# Altium project waffling60-SI.PrjPcb
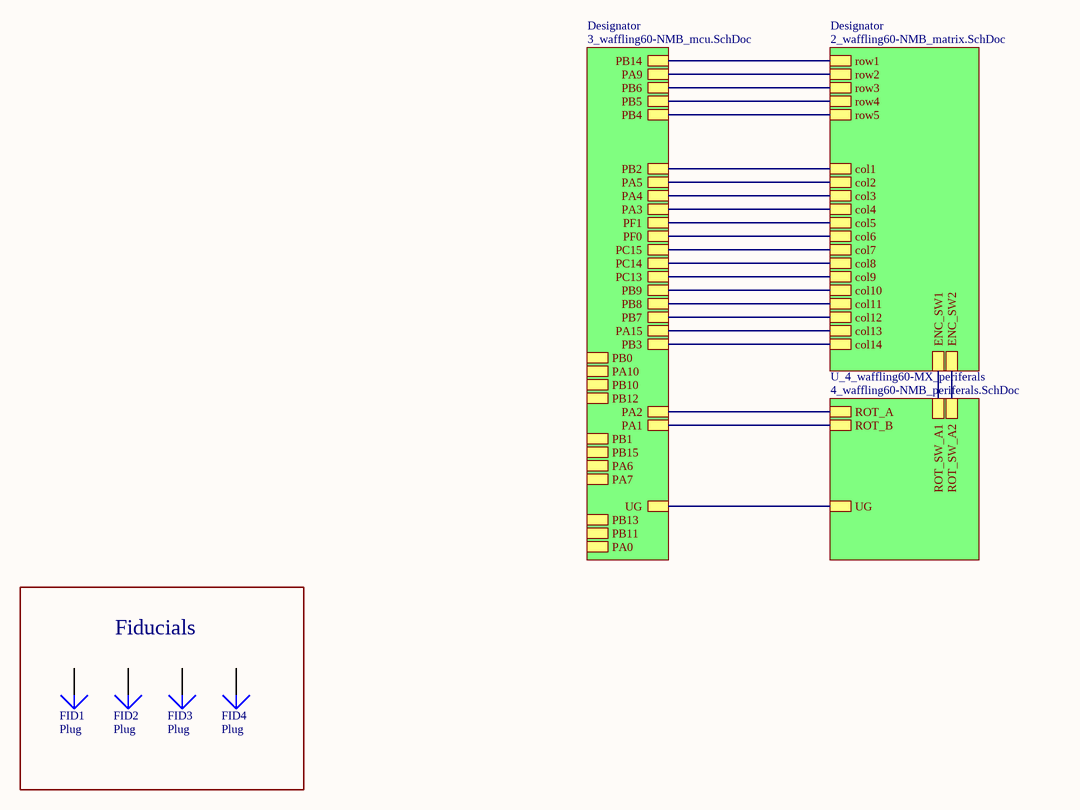
[diagram p0: 1_waffling60-NMB_top.SchDoc]
ProjectTitle: Waffling60 - MX Solder; Revision: D1
3 sheets, 191 parts. Net scope: hierarchical (ports join the sheet entries above them; power ports are global).
Board file: Waffling60-NMB.PcbDoc
Sheets:
  1_waffling60-NMB_top.SchDoc
    Designator = 3_waffling60-NMB_mcu.SchDoc
    Designator = 2_waffling60-NMB_matrix.SchDoc

## Sheet 1_waffling60-NMB_top.SchDoc: =ProjectTitle
size A4; Engineer: 4pplet; Address1: github.com/4pplet/waffling60; Address2: Licence: CERN-OHL-S; Revision: D1; SheetNumber: 1; SheetTotal: 3; ProjectName: waffling60

### Parts
FID1  Plug  [Fiducial_Nordic]  (no BOM)
FID2  Plug  [Fiducial_Nordic]  (no BOM)
FID3  Plug  [Fiducial_Nordic]  (no BOM)
FID4  Plug  [Fiducial_Nordic]  (no BOM)

### Blocks framed on the sheet
Fiducials: FID1-FID4

### Sub-sheets
Designator = 3_waffling60-NMB_mcu.SchDoc: PB8, PA3, PA4, PB11, PB12, PB15, PB13, PB3, PB0, PA9, PA5, PA2, PB7, PB9, PB10, PC14, PA0, PB6, PB2, PB1, PB4, PC15, PA10, PC13, PB14, PA7, PA1, PA6, PA15, PB5, PF1, PF0, UG
Designator = 2_waffling60-NMB_matrix.SchDoc: col6, col8, col5, col7, col3, col2, col1, col4, col9, row3, row1, row4, row2, row5, col11, col10, col14, col13, col12, ENC_SW1, ENC_SW2
U_4_waffling60-MX_periferals = 4_waffling60-NMB_periferals.SchDoc (file not in this document): ROT_A, ROT_B, ROT_SW_A1, ROT_SW_A2, UG

### Nets
col1: sheet Designator/PB2, sheet Designator/col1
col2: sheet Designator/PA5, sheet Designator/col2
col3: sheet Designator/PA4, sheet Designator/col3
col4: sheet Designator/PA3, sheet Designator/col4
col5: sheet Designator/PF1, sheet Designator/col5
col6: sheet Designator/PF0, sheet Designator/col6
col7: sheet Designator/PC15, sheet Designator/col7
col8: sheet Designator/PC14, sheet Designator/col8
col9: sheet Designator/PC13, sheet Designator/col9
col10: sheet Designator/PB9, sheet Designator/col10
col11: sheet Designator/PB8, sheet Designator/col11
col12: sheet Designator/PB7, sheet Designator/col12
col13: sheet Designator/PA15, sheet Designator/col13
col14: sheet Designator/PB3, sheet Designator/col14
PA1: sheet Designator/PA1, sheet U_4_waffling60-MX_periferals/ROT_B
PA2: sheet Designator/PA2, sheet U_4_waffling60-MX_periferals/ROT_A
PA9: sheet Designator/PA9, sheet Designator/row2
PB4: sheet Designator/PB4, sheet Designator/row5
PB5: sheet Designator/PB5, sheet Designator/row4
PB6: sheet Designator/PB6, sheet Designator/row3
PB14: sheet Designator/PB14, sheet Designator/row1
(unnamed): sheet Designator/UG, sheet U_4_waffling60-MX_periferals/UG
(unnamed): sheet Designator/ENC_SW1, sheet U_4_waffling60-MX_periferals/ROT_SW_A1
(unnamed): sheet Designator/ENC_SW2, sheet U_4_waffling60-MX_periferals/ROT_SW_A2

Not connected (* = marked no-connect by the designer): FID1 1; FID2 1; FID3 1; FID4 1

### Notes on the sheet
- Title
- Size:
- Date:
- A4
- Number:
- Time:
- Revision:
- Sheet
- of
- File:

## Sheet 3_waffling60-NMB_mcu.SchDoc: =ProjectTitle
size A4; Address1: github.com/4pplet/waffling60; Address2: Licence: CERN-OHL-S; Revision: D1; SheetNumber: 3; SheetTotal: 3
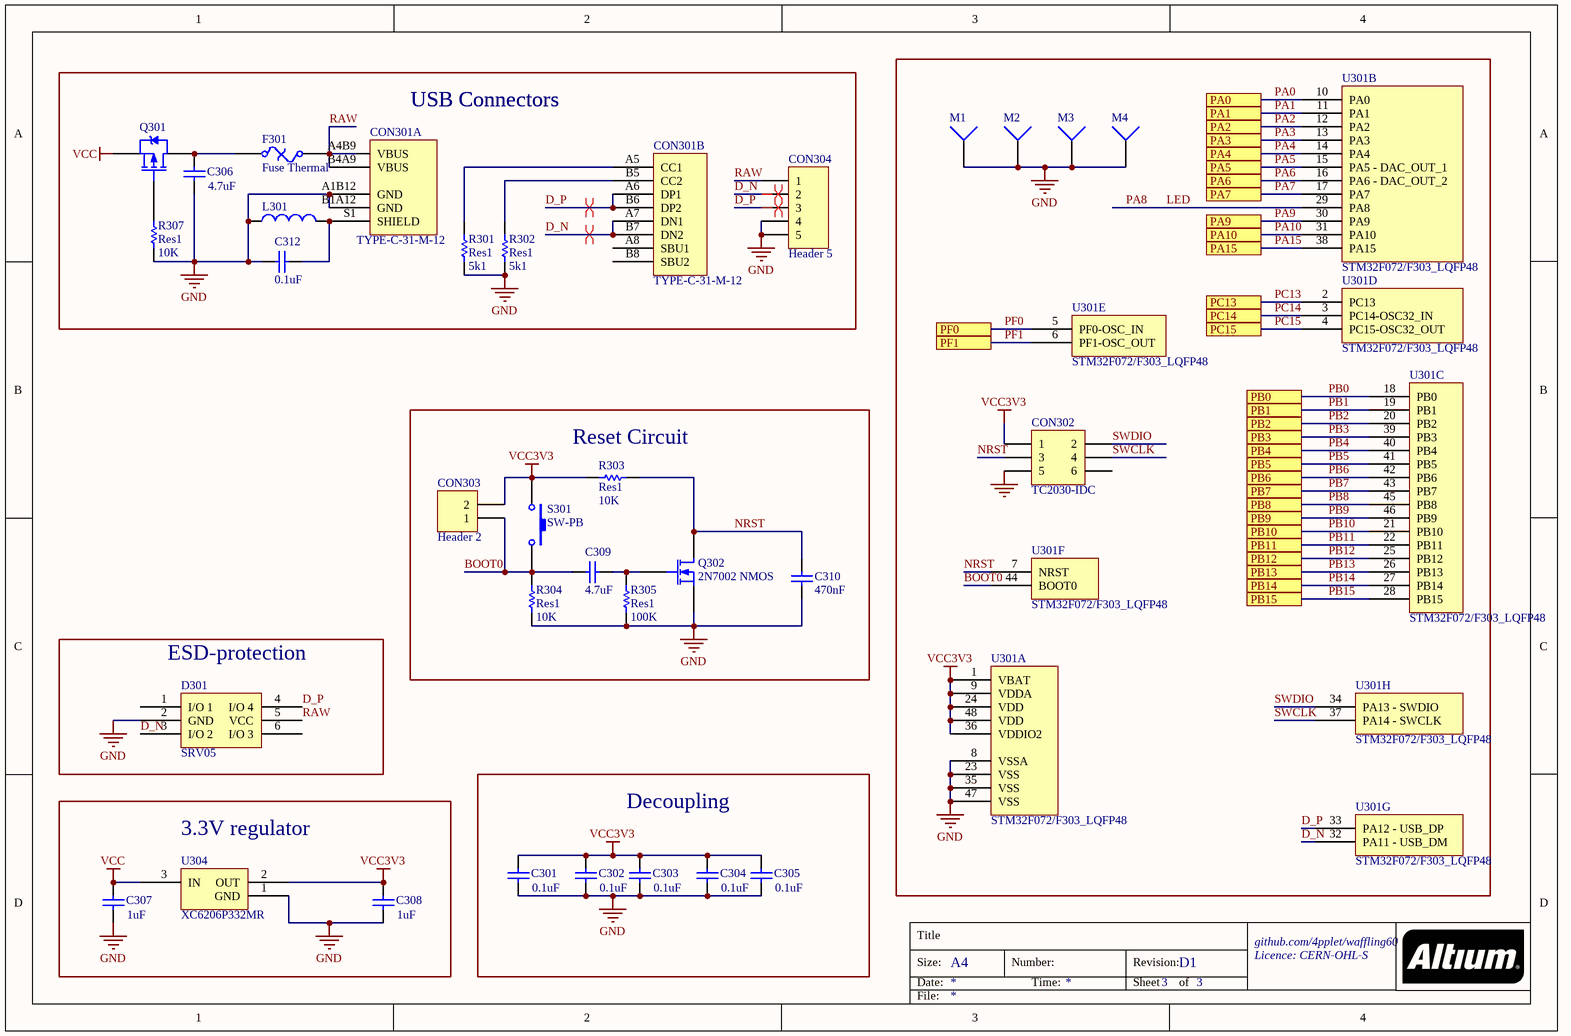
[diagram p1: 3_waffling60-NMB_mcu.SchDoc]

### Parts
C301  value 0.1uF  [C0603[1608]]
C302  value 0.1uF  [C0603[1608]]
C303  value 0.1uF  [C0603[1608]]
C304  value 0.1uF  [C0603[1608]]
C305  value 0.1uF  [C0603[1608]]
C306  value 4.7uF  [C0603[1608]]
C307  value 1uF  [C0603[1608]]
C308  value 1uF  [C0603[1608]]
C309  value 4.7uF  [C0603[1608]]
C310  value 470nF  [C0603[1608]]
C312  value 0.1uF  [C0603[1608]]
CON301  TYPE-C-31-M-12  [TYPE-C-31-M-12]  (parts A,B of 2)
CON302  TC2030-IDC  [TC2030-IDC-NL]  (no BOM)
CON303  Header 2  [HDR1X2]  (no BOM)
CON304  Header 5  [JST SM04B-SRSS-TB]
D301  SRV05  [SOT-23-6]
F301  Fuse Thermal  [C1206[3216]]
L301  Inductor  [L0805]  (value not drawn)
M1  Socket  [mounting_hole]  (value not drawn)  (no BOM)
M2  Socket  [mounting_hole]  (value not drawn)  (no BOM)
M3  Socket  [mounting_hole]  (value not drawn)  (no BOM)
M4  Socket  [mounting_hole]  (value not drawn)  (no BOM)
Q301  PMOS-2  [SOT-23-3]  (value not drawn)
Q302  2N7002 NMOS  [SOT-23-3]
R301  Res1  value 5k1  [R0603[1608]]
R302  Res1  value 5k1  [R0603[1608]]
R303  Res1  value 10K  [R0603[1608]]
R304  Res1  value 10K  [R0603[1608]]
R305  Res1  value 100K  [R0603[1608]]
R307  Res1  value 10K  [R0603[1608]]
S301  SW-PB  [XKB Switch]
U301  STM32F072/F303_LQFP48  [STM32 - COMBO 7X7MM]  (parts A,B,C,D,E,F,G,H of 8)
U304  XC6206P332MR  [SOT-23-3]

### Blocks framed on the sheet
Reset Circuit: C309 C310 CON303 Q302 R303-R305 S301
ESD-protection: D301
Decoupling: C301-C305
3.3V regulator: C307 C308 U304

### Ports
PA0, PA1, PA2, PA3, PA4, PA5, PA6, PA7, PA9, PA10, PA15, PB0, PB1, PB2, PB3, PB4, PB5, PB6, PB7, PB8, PB9, PB10, PB11, PB12, PB13, PB14, PB15, PC13, PC14, PC15, PF0, PF1

### Nets
GND: C301.1 C302.1 C303.1 C304.1 C305.1 C306.1 C307.1 C308.1 C310.2 C312.1 CON301.A1B12(GND) CON301.B1A12(GND) CON302.5 CON304.4 CON304.5 D301.2(GND) L301.1 M1.1 M2.1 M3.1 M4.1 Q302.2(S) R301.2 R302.2 R304.2 R305.2 R307.2 U301.8(VSSA) U301.23(VSS) U301.35(VSS) U301.47(VSS) U304.1(GND)
VCC: C307.2 Q301.2(S) U304.3(IN)
VCC3V3: C301.2 C302.2 C303.2 C304.2 C305.2 C308.2 CON302.1 CON303.2 R303.1 S301.1 U301.1(VBAT) U301.9(VDDA) U301.24(VDD) U301.36(VDDIO2) U301.48(VDD) U304.2(OUT)
BOOT0: C309.1 CON303.1 R304.1 S301.2 U301.44(BOOT0)
D_N: CON301.A7(DN1) CON301.B7(DN2) CON304.2 D301.3(I/O_2) U301.32(PA11_-_USB_DM)
D_P: CON301.A6(DP1) CON301.B6(DP2) CON304.3 D301.4(I/O_4) U301.33(PA12_-_USB_DP)
LED: U301.29(PA8)  [also labelled PA8]
NRST: C310.1 CON302.3 Q302.3(D) R303.2 U301.7(NRST)
PA0: U301.10(PA0) ; port PA0
PA1: U301.11(PA1) ; port PA1
PA2: U301.12(PA2) ; port PA2
PA3: U301.13(PA3) ; port PA3  [project net col4]
PA4: U301.14(PA4) ; port PA4  [project net col3]
PA5: U301.15(PA5_-_DAC_OUT_1) ; port PA5  [project net col2]
PA6: U301.16(PA6_-_DAC_OUT_2) ; port PA6
PA7: U301.17(PA7) ; port PA7
PA9: U301.30(PA9) ; port PA9
PA10: U301.31(PA10) ; port PA10
PA15: U301.38(PA15) ; port PA15  [project net col13]
PB0: U301.18(PB0) ; port PB0
PB1: U301.19(PB1) ; port PB1
PB2: U301.20(PB2) ; port PB2  [project net col1]
PB3: U301.39(PB3) ; port PB3  [project net col14]
PB4: U301.40(PB4) ; port PB4
PB5: U301.41(PB5) ; port PB5
PB6: U301.42(PB6) ; port PB6
PB7: U301.43(PB7) ; port PB7  [project net col12]
PB8: U301.45(PB8) ; port PB8  [project net col11]
PB9: U301.46(PB9) ; port PB9  [project net col10]
PB10: U301.21(PB10) ; port PB10
PB11: U301.22(PB11) ; port PB11
PB12: U301.25(PB12) ; port PB12
PB13: U301.26(PB13) ; port PB13
PB14: U301.27(PB14) ; port PB14
PB15: U301.28(PB15) ; port PB15
PC13: U301.2(PC13) ; port PC13  [project net col9]
PC14: U301.3(PC14-OSC32_IN) ; port PC14  [project net col8]
PC15: U301.4(PC15-OSC32_OUT) ; port PC15  [project net col7]
PF0: U301.5(PF0-OSC_IN) ; port PF0  [project net col6]
PF1: U301.6(PF1-OSC_OUT) ; port PF1  [project net col5]
RAW: CON301.A4B9(VBUS) CON301.B4A9(VBUS) CON304.1 D301.5(VCC) F301.2
SWCLK: CON302.4 U301.37(PA14_-_SWCLK)
SWDIO: CON302.2 U301.34(PA13_-_SWDIO)
NetC306_2: C306.2 F301.1 Q301.3(D)
NetC309_2: C309.2 Q302.1(G) R305.1
NetC312_2: C312.2 CON301.S1(SHIELD) L301.2
NetCON301_A5: CON301.A5(CC1) R301.1
NetCON301_B5: CON301.B5(CC2) R302.1
NetQ301_1: Q301.1(G) R307.1

Not connected (* = marked no-connect by the designer): CON301 A8(SBU1) B8(SBU2); CON302 6; D301 1(I/O_1) 6(I/O_3)

### Layout directives
differential pair: D_N, D_P

### Notes on the sheet
- USB Connectors
- Title
- Size:
- Date:
- A4
- Number:
- Time:
- Revision:
- Sheet
- of
- File:

### Library data of the parts
C301-C305 C312 = Cap: Capacitor; MRF.Part: CC0603KRX7R9BB104; LCSC MFG: YAGEO; Version: 0603 imperial; LCSC Part #: C14663
C306 C309 = Cap: Capacitor; MRF.Part: CL10A475KO8NNNC; LCSC MFG: Samsung Electro-Mechanics; Version: 0603 imperial; LCSC Part #: C19666
C307 C308 = Cap: Capacitor; MRF.Part: CL10A105KB8NNNC; LCSC MFG: Samsung Electro-Mechanics; Version: 0603 imperial; LCSC Part #: C15849
C310 = Cap: Capacitor; MRF.Part: CL10B474KA8NNNC; LCSC MFG: Samsung Electro-Mechanics; Version: 0603 imperial; LCSC Part #: C1623
CON301 = TYPE-C-31-M-12: LCSC MFG: Korean Hroparts Elec; LCSC Part #: C165948; MRF.Part: TYPE-C-31-M-12
CON302 = Header 3X2: Header, 3-Pin, Dual row
CON303 = Header 2: Header, 2-Pin
CON304 = Header 5: JST for USB daughter board; MRF.Part: SM04B-SRSS-TB(LF)(SN); LCSC MFG: JST Sales America; LCSC Part #: C160404
D301 = SRV05: MRF.Part: SRV05-4-P-T7; LCSC MFG: ProTek Devices; LCSC Part #: C85364
F301 = Fuse Thermal: Thermal Fuse; MRF.Part: ASMD1206-050; LCSC MFG: Shenzhen JDT Fuse; LCSC Part #: C135338
L301 = Inductor: MRF.Part: GZ2012D101TF; LCSC MFG: Sunlord; LCSC Part #: C1015; Version: 0806 imperial
Q301 = PMOS-2: P-Channel Power MOSFET; MRF.Part: SI2301CDS-T1-GE3; LCSC MFG: Vishay Intertech; LCSC Part #: C10487; Version: SOT23-3
Q302 = MOSFET-N: N-Channel MOSFET; LCSC MFG: Changjiang Electronics Tech (CJ); LCSC Part #: C8545; MRF.Part: 2N7002
R301 R302 = Res1: Resistor; MRF.Part: 0603WAF5101T5E; LCSC MFG: Uniroyal Elec; Version: 0603 imperial; LCSC Part #: C23186
R303 R304 R307 = Res1: Resistor; MRF.Part: 0603WAF1002T5E; LCSC MFG: Uniroyal Elec; Version: 0603 imperial; LCSC Part #: C25804
R305 = Res1: Resistor; MRF.Part: 0603WAF1003T5E; LCSC MFG: Uniroyal Elec; Version: 0603 imperial; LCSC Part #: C25803
S301 = SW-PB: Switch; MRF.Part: TS-1187A-C-D-B; LCSC MFG: XKB Enterprise; LCSC Part #: C318888
U301 = STM32F072/F303_LQFP48: MRF.Part: APM32F072CBT6; LCSC MFG: Geehy; LCSC Part #: C915660
U304 = SOT23 LDO: LCSC MFG: Torex Semicon; LCSC Part #: C5446; MRF.Part: XC6206P332MR

## Sheet 2_waffling60-NMB_matrix.SchDoc: =ProjectTitle
size A3; Address1: github.com/4pplet/waffling60; Address2: Licence: CERN-OHL-S; Revision: D1; SheetNumber: 2; SheetTotal: 3
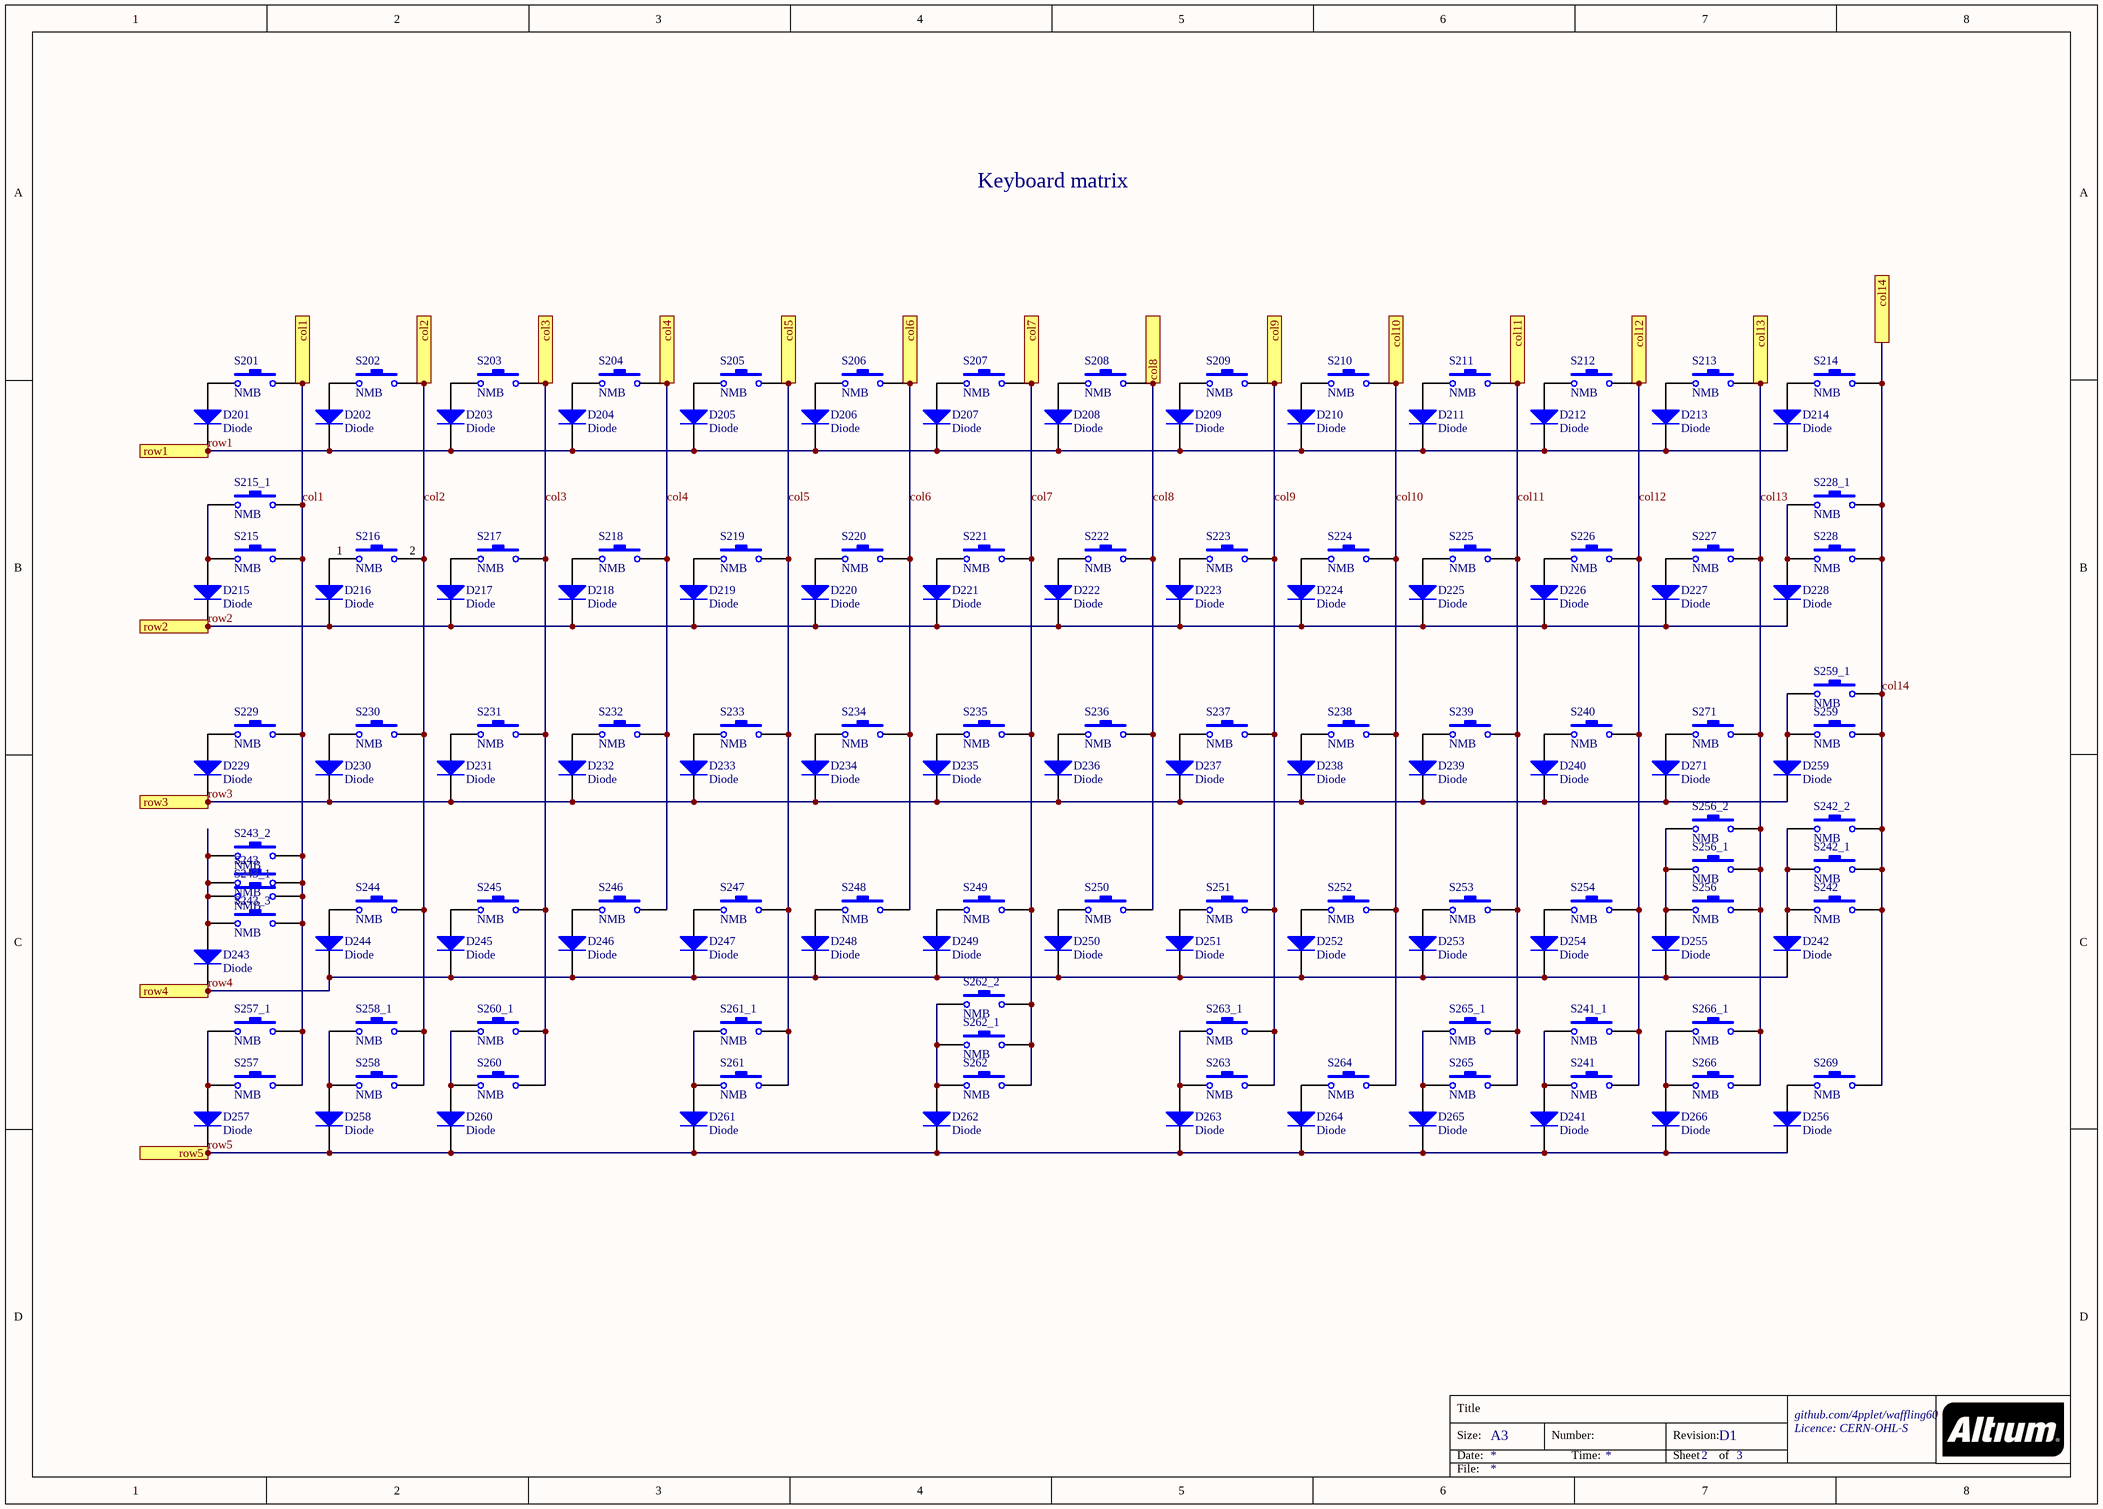
[diagram p2: 2_waffling60-NMB_matrix.SchDoc]

### Parts
D201  Diode  [SOD-123]
D202  Diode  [SOD-123]
D203  Diode  [SOD-123]
D204  Diode  [SOD-123]
D205  Diode  [SOD-123]
D206  Diode  [SOD-123]
D207  Diode  [SOD-123]
D208  Diode  [SOD-123]
D209  Diode  [SOD-123]
D210  Diode  [SOD-123]
D211  Diode  [SOD-123]
D212  Diode  [SOD-123]
D213  Diode  [SOD-123]
D214  Diode  [SOD-123]
D215  Diode  [SOD-123]
D216  Diode  [SOD-123]
D217  Diode  [SOD-123]
D218  Diode  [SOD-123]
D219  Diode  [SOD-123]
D220  Diode  [SOD-123]
D221  Diode  [SOD-123]
D222  Diode  [SOD-123]
D223  Diode  [SOD-123]
D224  Diode  [SOD-123]
D225  Diode  [SOD-123]
D226  Diode  [SOD-123]
D227  Diode  [SOD-123]
D228  Diode  [SOD-123]
D229  Diode  [SOD-123]
D230  Diode  [SOD-123]
D231  Diode  [SOD-123]
D232  Diode  [SOD-123]
D233  Diode  [SOD-123]
D234  Diode  [SOD-123]
D235  Diode  [SOD-123]
D236  Diode  [SOD-123]
D237  Diode  [SOD-123]
D238  Diode  [SOD-123]
D239  Diode  [SOD-123]
D240  Diode  [SOD-123]
D241  Diode  [SOD-123]
D242  Diode  [SOD-123]
D243  Diode  [SOD-123]
D244  Diode  [SOD-123]
D245  Diode  [SOD-123]
D246  Diode  [SOD-123]
D247  Diode  [SOD-123]
D248  Diode  [SOD-123]
D249  Diode  [SOD-123]
D250  Diode  [SOD-123]
D251  Diode  [SOD-123]
D252  Diode  [SOD-123]
D253  Diode  [SOD-123]
D254  Diode  [SOD-123]
D255  Diode  [SOD-123]
D256  Diode  [SOD-123]
D257  Diode  [SOD-123]
D258  Diode  [SOD-123]
D259  Diode  [SOD-123]
D260  Diode  [SOD-123]
D261  Diode  [SOD-123]
D262  Diode  [SOD-123]
D263  Diode  [SOD-123]
D264  Diode  [SOD-123]
D265  Diode  [SOD-123]
D266  Diode  [SOD-123]
D271  Diode  [SOD-123]
S201  NMB  [NMB-Switch 1U - switched pol  - no allignment pins]  (no BOM)
S202  NMB  [NMB-Switch 1U - no allignment pins]  (no BOM)
S203  NMB  [NMB-Switch 1U - switched pol  - no allignment pins]  (no BOM)
S204  NMB  [NMB-Switch 1U - switched pol  - no allignment pins]  (no BOM)
S205  NMB  [NMB-Switch 1U - switched pol  - no allignment pins]  (no BOM)
S206  NMB  [NMB-Switch 1U - switched pol  - no allignment pins]  (no BOM)
S207  NMB  [NMB-Switch 1U - switched pol  - no allignment pins]  (no BOM)
S208  NMB  [NMB-Switch 1U - switched pol  - no allignment pins]  (no BOM)
S209  NMB  [NMB-Switch 1U - switched pol  - no allignment pins]  (no BOM)
S210  NMB  [NMB-Switch 1U - switched pol  - no allignment pins]  (no BOM)
S211  NMB  [NMB-Switch 1U - switched pol  - no allignment pins]  (no BOM)
S212  NMB  [NMB-Switch 1U - switched pol  - no allignment pins]  (no BOM)
S213  NMB  [NMB-Switch 1U - switched pol  - no allignment pins]  (no BOM)
S214  NMB  [NMB-Switch 1U - no allignment pins]  (no BOM)
S215  NMB  [NMB-Switch 1U - switched pol  - no allignment pins]  (no BOM)
S215_1  NMB  [NMB-Switch 1U - switched pol  - no allignment pins]  (no BOM)
S216  NMB  [NMB-Switch 1U - no allignment pins]  (no BOM)
S217  NMB  [NMB-Switch 1U - switched pol  - no allignment pins]  (no BOM)
S218  NMB  [NMB-Switch 1U - switched pol  - no allignment pins]  (no BOM)
S219  NMB  [NMB-Switch 1U - switched pol  - no allignment pins]  (no BOM)
S220  NMB  [NMB-Switch 1U - no allignment pins]  (no BOM)
S221  NMB  [NMB-Switch 1U - switched pol  - no allignment pins]  (no BOM)
S222  NMB  [NMB-Switch 1U - no allignment pins]  (no BOM)
S223  NMB  [NMB-Switch 1U - switched pol  - no allignment pins]  (no BOM)
S224  NMB  [NMB-Switch 1U - switched pol  - no allignment pins]  (no BOM)
S225  NMB  [NMB-Switch 1U - switched pol  - no allignment pins]  (no BOM)
S226  NMB  [NMB-Switch 1U - no allignment pins]  (no BOM)
S227  NMB  [NMB-Switch 1U - no allignment pins]  (no BOM)
S228  NMB  [NMB-Switch 1U - no allignment pins]  (no BOM)
S228_1  NMB  [NMB-Switch 1U - no allignment pins]  (no BOM)
S229  NMB  [NMB-Switch 1U - no allignment pins]  (no BOM)
S230  NMB  [NMB-Switch 1U - no allignment pins]  (no BOM)
S231  NMB  [NMB-Switch 1U - switched pol  - no allignment pins]  (no BOM)
S232  NMB  [NMB-Switch 1U - switched pol  - no allignment pins]  (no BOM)
S233  NMB  [NMB-Switch 1U - switched pol  - no allignment pins]  (no BOM)
S234  NMB  [NMB-Switch 1U - switched pol  - no allignment pins]  (no BOM)
S235  NMB  [NMB-Switch 1U - switched pol  - no allignment pins]  (no BOM)
S236  NMB  [NMB-Switch 1U - switched pol  - no allignment pins]  (no BOM)
S237  NMB  [NMB-Switch 1U - switched pol  - no allignment pins]  (no BOM)
S238  NMB  [NMB-Switch 1U - switched pol  - no allignment pins]  (no BOM)
S239  NMB  [NMB-Switch 1U - switched pol  - no allignment pins]  (no BOM)
S240  NMB  [NMB-Switch 1U - switched pol  - no allignment pins]  (no BOM)
S241  NMB  [NMB-Switch 1U - no allignment pins]  (no BOM)
S241_1  NMB  [NMB-Switch 1U - no allignment pins]  (no BOM)
S242  NMB  [NMB-Switch 1U - switched pol  - no allignment pins]  (no BOM)
S242_1  NMB  [NMB-Switch 1U - no allignment pins]  (no BOM)
S242_2  NMB  [NMB-Switch 1U - switched pol  - no allignment pins]  (no BOM)
S243  NMB  [NMB-Switch 1U - switched pol  - no allignment pins]  (no BOM)
S243_1  NMB  [NMB-Switch 1U - switched pol  - no allignment pins]  (no BOM)
S243_2  NMB  [NMB-Switch 1U - no allignment pins]  (no BOM)
S243_3  NMB  [NMB-Switch 1U - no allignment pins]  (no BOM)
S244  NMB  [NMB-Switch 1U - no allignment pins]  (no BOM)
S245  NMB  [NMB-Switch 1U - switched pol  - no allignment pins]  (no BOM)
S246  NMB  [NMB-Switch 1U - switched pol  - no allignment pins]  (no BOM)
S247  NMB  [NMB-Switch 1U - switched pol  - no allignment pins]  (no BOM)
S248  NMB  [NMB-Switch 1U - switched pol  - no allignment pins]  (no BOM)
S249  NMB  [NMB-Switch 1U - switched pol  - no allignment pins]  (no BOM)
S250  NMB  [NMB-Switch 1U - switched pol  - no allignment pins]  (no BOM)
S251  NMB  [NMB-Switch 1U - switched pol  - no allignment pins]  (no BOM)
S252  NMB  [NMB-Switch 1U - switched pol  - no allignment pins]  (no BOM)
S253  NMB  [NMB-Switch 1U - switched pol  - no allignment pins]  (no BOM)
S254  NMB  [NMB-Switch 1U - switched pol  - no allignment pins]  (no BOM)
S256  NMB  [NMB-Switch 1U - switched pol  - no allignment pins]  (no BOM)
S256_1  NMB  [NMB-Switch 1U - switched pol  - no allignment pins]  (no BOM)
S256_2  NMB  [NMB-Switch 1U - no allignment pins]  (no BOM)
S257  NMB  [NMB-Switch 1U - no allignment pins]  (no BOM)
S257_1  NMB  [NMB-Switch 1U - no allignment pins]  (no BOM)
S258  NMB  [NMB-Switch 1U - no allignment pins]  (no BOM)
S258_1  NMB  [NMB-Switch 1U - no allignment pins]  (no BOM)
S259  NMB  [NMB-Switch 1U - no allignment pins]  (no BOM)
S259_1  NMB  [NMB-Switch 1U - no allignment pins]  (no BOM)
S260  NMB  [NMB-Switch 1U - no allignment pins]  (no BOM)
S260_1  NMB  [NMB-Switch 1U - no allignment pins]  (no BOM)
S261  NMB  [NMB-Switch 1U - no allignment pins]  (no BOM)
S261_1  NMB  [NMB-Switch 1U - no allignment pins]  (no BOM)
S262  NMB  [NMB-Switch 1U - no allignment pins]  (no BOM)
S262_1  NMB  [NMB-Switch 1U - no allignment pins]  (no BOM)
S262_2  NMB  [NMB-Switch 1U - no allignment pins]  (no BOM)
S263  NMB  [NMB-Switch 1U - no allignment pins]  (no BOM)
S263_1  NMB  [NMB-Switch 1U - no allignment pins]  (no BOM)
S264  NMB  [NMB-Switch 1U - switched pol  - no allignment pins]  (no BOM)
S265  NMB  [NMB-Switch 1U - no allignment pins]  (no BOM)
S265_1  NMB  [NMB-Switch 1U - no allignment pins]  (no BOM)
S266  NMB  [NMB-Switch 1U - no allignment pins]  (no BOM)
S266_1  NMB  [NMB-Switch 1U - no allignment pins]  (no BOM)
S269  NMB  [NMB-Switch 1U - no allignment pins]  (no BOM)
S271  NMB  [NMB-Switch 1U - no allignment pins]  (no BOM)

### Ports
col1, col2, col3, col4, col5, col6, col7, col8, col9, col10, col11, col12, col13, col14, row1, row2, row3, row4, row5

### Nets
col1: S201.2 S215.2 S215_1.2 S229.1 S243.2 S243_1.2 S243_2.2 S243_3.2 S257.1 S257_1.1 ; port col1
col2: S202.2 S216.2 S230.2 S244.1 S258.2 S258_1.1 ; port col2
col3: S203.2 S217.2 S231.2 S245.2 S260.2 S260_1.1 ; port col3
col4: S204.2 S218.2 S232.2 S246.2 ; port col4
col5: S205.2 S219.2 S233.2 S247.2 S261.2 S261_1.2 ; port col5
col6: S206.2 S220.2 S234.2 S248.2 ; port col6
col7: S207.2 S221.2 S235.2 S249.2 S262.1 S262_1.1 S262_2.1 ; port col7
col8: S208.2 S222.2 S236.2 S250.2 ; port col8
col9: S209.2 S223.2 S237.2 S251.2 S263.1 S263_1.1 ; port col9
col10: S210.2 S224.2 S238.2 S252.2 S264.2 ; port col10
col11: S211.2 S225.2 S239.2 S253.2 S265.1 S265_1.1 ; port col11
col12: S212.2 S226.2 S240.2 S241.1 S241_1.1 S254.2 ; port col12
col13: S213.2 S227.2 S256.2 S256_1.2 S256_2.2 S266.2 S266_1.2 S271.2 ; port col13
col14: S214.2 S228.2 S228_1.2 S242.2 S242_1.2 S242_2.2 S259.1 S259_1.2 S269.2 ; port col14
row1: D201.2(K) D202.2(K) D203.2(K) D204.2(K) D205.2(K) D206.2(K) D207.2(K) D208.2(K) D209.2(K) D210.2(K) D211.2(K) D212.2(K) D213.2(K) D214.2(K) ; port row1  [project net PB14]
row2: D215.2(K) D216.2(K) D217.2(K) D218.2(K) D219.2(K) D220.2(K) D221.2(K) D222.2(K) D223.2(K) D224.2(K) D225.2(K) D226.2(K) D227.2(K) D228.2(K) ; port row2  [project net PA9]
row3: D229.2(K) D230.2(K) D231.2(K) D232.2(K) D233.2(K) D234.2(K) D235.2(K) D236.2(K) D237.2(K) D238.2(K) D239.2(K) D240.2(K) D259.2(K) D271.2(K) ; port row3  [project net PB6]
row4: D242.2(K) D243.2(K) D244.2(K) D245.2(K) D246.2(K) D247.2(K) D248.2(K) D249.2(K) D250.2(K) D251.2(K) D252.2(K) D253.2(K) D254.2(K) D255.2(K) ; port row4  [project net PB5]
row5: D241.2(K) D256.2(K) D257.2(K) D258.2(K) D260.2(K) D261.2(K) D262.2(K) D263.2(K) D264.2(K) D265.2(K) D266.2(K) ; port row5  [project net PB4]
NetD201_1: D201.1(A) S201.1
NetD202_1: D202.1(A) S202.1
NetD203_1: D203.1(A) S203.1
NetD204_1: D204.1(A) S204.1
NetD205_1: D205.1(A) S205.1
NetD206_1: D206.1(A) S206.1
NetD207_1: D207.1(A) S207.1
NetD208_1: D208.1(A) S208.1
NetD209_1: D209.1(A) S209.1
NetD210_1: D210.1(A) S210.1
NetD211_1: D211.1(A) S211.1
NetD212_1: D212.1(A) S212.1
NetD213_1: D213.1(A) S213.1
NetD214_1: D214.1(A) S214.1
NetD215_1: D215.1(A) S215.1 S215_1.1
NetD216_1: D216.1(A) S216.1
NetD217_1: D217.1(A) S217.1
NetD218_1: D218.1(A) S218.1
NetD219_1: D219.1(A) S219.1
NetD220_1: D220.1(A) S220.1
NetD221_1: D221.1(A) S221.1
NetD222_1: D222.1(A) S222.1
NetD223_1: D223.1(A) S223.1
NetD224_1: D224.1(A) S224.1
NetD225_1: D225.1(A) S225.1
NetD226_1: D226.1(A) S226.1
NetD227_1: D227.1(A) S227.1
NetD228_1: D228.1(A) S228.1 S228_1.1
NetD229_1: D229.1(A) S229.2
NetD230_1: D230.1(A) S230.1
NetD231_1: D231.1(A) S231.1
NetD232_1: D232.1(A) S232.1
NetD233_1: D233.1(A) S233.1
NetD234_1: D234.1(A) S234.1
NetD235_1: D235.1(A) S235.1
NetD236_1: D236.1(A) S236.1
NetD237_1: D237.1(A) S237.1
NetD238_1: D238.1(A) S238.1
NetD239_1: D239.1(A) S239.1
NetD240_1: D240.1(A) S240.1
NetD241_1: D241.1(A) S241.2 S241_1.2
NetD242_1: D242.1(A) S242.1 S242_1.1 S242_2.1
NetD243_1: D243.1(A) S243.1 S243_1.1 S243_2.1 S243_3.1
NetD244_1: D244.1(A) S244.2
NetD245_1: D245.1(A) S245.1
NetD246_1: D246.1(A) S246.1
NetD247_1: D247.1(A) S247.1
NetD248_1: D248.1(A) S248.1
NetD249_1: D249.1(A) S249.1
NetD250_1: D250.1(A) S250.1
NetD251_1: D251.1(A) S251.1
NetD252_1: D252.1(A) S252.1
NetD253_1: D253.1(A) S253.1
NetD254_1: D254.1(A) S254.1
NetD255_1: D255.1(A) S256.1 S256_1.1 S256_2.1
NetD256_1: D256.1(A) S269.1
NetD257_1: D257.1(A) S257.2 S257_1.2
NetD258_1: D258.1(A) S258.1 S258_1.2
NetD259_1: D259.1(A) S259.1 S259_1.1
NetD260_1: D260.1(A) S260.1 S260_1.2
NetD261_1: D261.1(A) S261.1 S261_1.1
NetD262_1: D262.1(A) S262.2 S262_1.2 S262_2.2
NetD263_1: D263.1(A) S263.2 S263_1.2
NetD264_1: D264.1(A) S264.1
NetD265_1: D265.1(A) S265.2 S265_1.2
NetD266_1: D266.1(A) S266.1 S266_1.1
NetD271_1: D271.1(A) S271.1

### Notes on the sheet
- Keyboard matrix
- Title
- Size:
- Date:
- A3
- Number:
- Time:
- Revision:
- Sheet
- of
- File:

### Library data of the parts
D201-D266 D271 = Diode: Default Diode; MRF.Part: 1N4148W; LCSC MFG: ST(Semtech); Version: SOD-123; LCSC Part #: C81598
S201-S214 S216-S228 S228_1 S229-S241 S241_1 S242 S242_1 S242_2 S243 S243_1-S243_3 S244-S254 S256 S256_1 S256_2 S257 S257_1 S258 S258_1 S259 S259_1 S260 S260_1 S261 S261_1 S262 S262_1 S262_2 S263 S263_1 S264 S265 S265_1 S266 S266_1 S269 S271 = SW-PB: Switch
S215 S215_1 = SW-PB: TAB

## Nets that join several sheets
col1: 3_waffling60-NMB_mcu (U301.20), 2_waffling60-NMB_matrix (10 pins)
col2: 3_waffling60-NMB_mcu (U301.15), 2_waffling60-NMB_matrix (6 pins)
col3: 3_waffling60-NMB_mcu (U301.14), 2_waffling60-NMB_matrix (6 pins)
col4: 3_waffling60-NMB_mcu (U301.13), 2_waffling60-NMB_matrix (S204.2 S218.2 S232.2 S246.2)
col5: 3_waffling60-NMB_mcu (U301.6), 2_waffling60-NMB_matrix (6 pins)
col6: 3_waffling60-NMB_mcu (U301.5), 2_waffling60-NMB_matrix (S206.2 S220.2 S234.2 S248.2)
col7: 3_waffling60-NMB_mcu (U301.4), 2_waffling60-NMB_matrix (7 pins)
col8: 3_waffling60-NMB_mcu (U301.3), 2_waffling60-NMB_matrix (S208.2 S222.2 S236.2 S250.2)
col9: 3_waffling60-NMB_mcu (U301.2), 2_waffling60-NMB_matrix (6 pins)
col10: 3_waffling60-NMB_mcu (U301.46), 2_waffling60-NMB_matrix (5 pins)
col11: 3_waffling60-NMB_mcu (U301.45), 2_waffling60-NMB_matrix (6 pins)
col12: 3_waffling60-NMB_mcu (U301.43), 2_waffling60-NMB_matrix (6 pins)
col13: 3_waffling60-NMB_mcu (U301.38), 2_waffling60-NMB_matrix (8 pins)
col14: 3_waffling60-NMB_mcu (U301.39), 2_waffling60-NMB_matrix (9 pins)
PA9: 3_waffling60-NMB_mcu (U301.30), 2_waffling60-NMB_matrix (14 pins)
PB4: 3_waffling60-NMB_mcu (U301.40), 2_waffling60-NMB_matrix (11 pins)
PB5: 3_waffling60-NMB_mcu (U301.41), 2_waffling60-NMB_matrix (14 pins)
PB6: 3_waffling60-NMB_mcu (U301.42), 2_waffling60-NMB_matrix (14 pins)
PB14: 3_waffling60-NMB_mcu (U301.27), 2_waffling60-NMB_matrix (14 pins)

## Assembly variants
Tray: not fitted CON303 CON304 D302 R308 R309
Bakeneko: not fitted CON301 CON303 D301 D302 R307 R308 R309 R310
Wilba: not fitted CON301 CON304 D301 R304 R305 R307 R310
All: all parts fitted